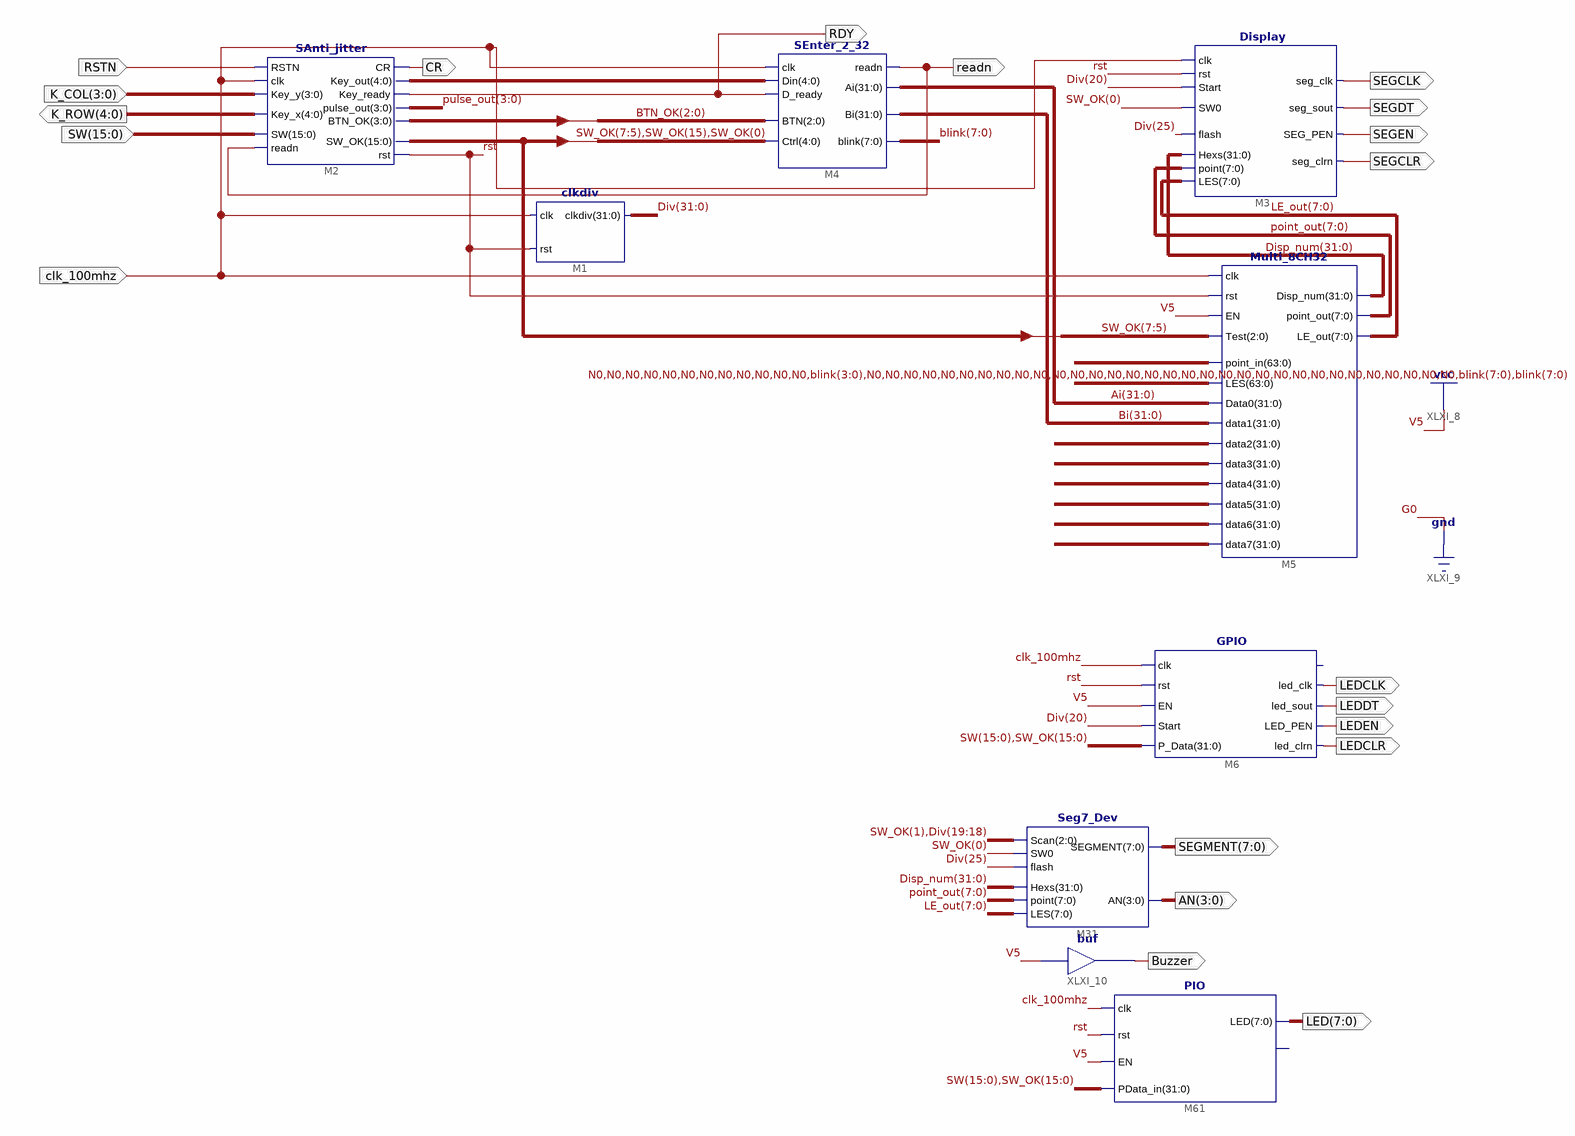
[diagram p0: schematic sheet 1]
// Xilinx ISE schematic Main.sch (kintex7) as structural Verilog: 9 symbols, 20 ports
module Main (
  input  RSTN,
  input  [3:0] K_COL,
  input  [15:0] SW,
  input  clk_100mhz,
  output [4:0] K_ROW,
  output CR,
  output readn,
  output SEGCLK,
  output SEGDT,
  output SEGEN,
  output SEGCLR,
  output LEDCLK,
  output LEDDT,
  output LEDEN,
  output LEDCLR,
  output [7:0] LED,
  output Buzzer,
  output [7:0] SEGMENT,
  output [3:0] AN,
  output RDY
);

  wire N0, rst;
  wire [3:0] BTN_OK, pulse_out;
  wire [4:0] XLXN_43;
  wire [7:0] blink, LE_out, point_out;
  wire [15:0] SW_OK;
  wire [31:0] Ai, Bi, Disp_num, Div, XLXN_57, XLXN_59, XLXN_60, XLXN_61, XLXN_65, XLXN_67;
  wire [63:0] XLXN_70;

  SAnti_jitter M2 (
    .SW(SW), .readn(readn), .Key_y(K_COL), .Key_x(K_ROW), .RSTN(RSTN), .clk(clk_100mhz), .Key_out(XLXN_43),
    .Key_ready(RDY), .CR(CR), .rst(rst), .SW_OK(SW_OK), .pulse_out(pulse_out), .BTN_OK(BTN_OK));
  clkdiv M1 (.rst(rst), .clkdiv(Div), .clk(clk_100mhz));
  SEnter_2_32 M4 (
    .readn(readn), .Ai(Ai), .Bi(Bi), .blink(blink), .Din(XLXN_43), .D_ready(RDY), .clk(clk_100mhz),
    .Ctrl({SW_OK[7:5], SW_OK[15], SW_OK[0]}), .BTN(BTN_OK[2:0]));
  Display M3 (
    .LES(LE_out), .SEG_PEN(SEGEN), .seg_sout(SEGDT), .seg_clrn(SEGCLR), .point(point_out), .Hexs(Disp_num),
    .SW0(SW_OK[0]), .flash(Div[25]), .seg_clk(SEGCLK), .clk(clk_100mhz), .rst(rst), .Start(Div[20]));
  GPIO M6 (
    .clk(clk_100mhz), .P_Data({SW, SW_OK}), .rst(rst), .EN(1'b1), .Start(Div[20]), .led_clrn(LEDCLR),
    .led_clk(LEDCLK), .led_sout(LEDDT), .LED_PEN(LEDEN));  // open: GPIOf0
  Multi_8CH32 M5 (
    .Test(SW_OK[7:5]), .point_in(XLXN_70), .EN(1'b1), .clk(clk_100mhz), .rst(rst),
    .LES({{12{N0}}, blink[3:0], {32{N0}}, blink, blink}), .Data0(Ai), .data1(Bi), .data2(XLXN_57),
    .data3(XLXN_59), .data4(XLXN_60), .data5(XLXN_61), .data6(XLXN_65), .data7(XLXN_67),
    .point_out(point_out), .LE_out(LE_out), .Disp_num(Disp_num));
  Seg7_Dev M31 (
    .LES(LE_out), .Scan({SW_OK[1], Div[19:18]}), .SEGMENT(SEGMENT), .AN(AN), .point(point_out),
    .flash(Div[25]), .SW0(SW_OK[0]), .Hexs(Disp_num));
  PIO M61 (.clk(clk_100mhz), .rst(rst), .EN(1'b1), .PData_in({SW, SW_OK}), .LED(LED));  // open: GPIOf0
  buf XLXI_10 (Buzzer, 1'b1);
endmodule
